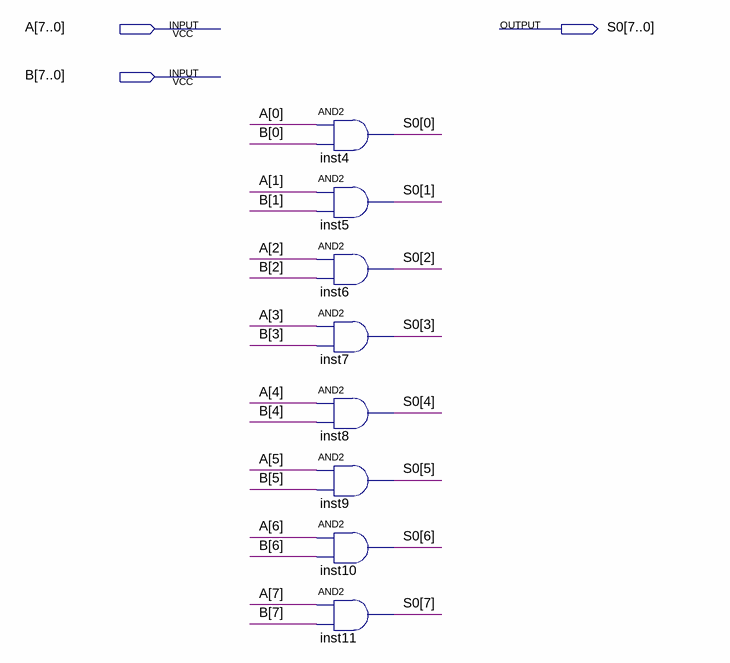
[diagram p0: schematic sheet]
// Quartus schematic AND8b.bdf as structural Verilog: 8 symbols, 3 pins
module AND8b (
  input  [7:0] A,
  input  [7:0] B,
  output [7:0] S0
);

  and inst4 (S0[0], A[0], B[0]);
  and inst5 (S0[1], A[1], B[1]);
  and inst6 (S0[2], A[2], B[2]);
  and inst7 (S0[3], A[3], B[3]);
  and inst8 (S0[4], A[4], B[4]);
  and inst9 (S0[5], A[5], B[5]);
  and inst10 (S0[6], A[6], B[6]);
  and inst11 (S0[7], A[7], B[7]);
endmodule
